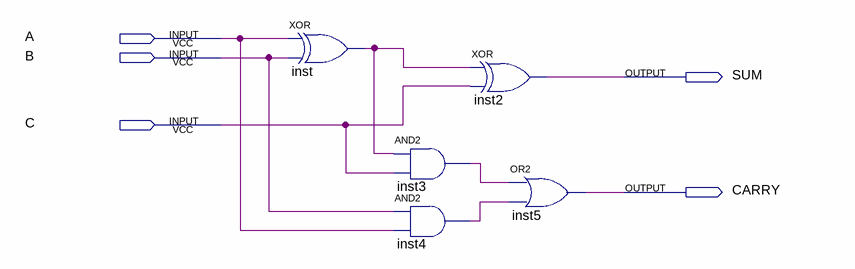
[diagram p0: schematic sheet]
// Quartus schematic 2BitAdder.bdf as structural Verilog: 5 symbols, 5 pins
module \2BitAdder  (
  input  A,
  input  B,
  input  C,
  output SUM,
  output CARRY
);

  wire inst3_out, inst4_out, inst_out;

  xor inst (inst_out, A, B);
  and inst3 (inst3_out, inst_out, C);
  and inst4 (inst4_out, B, A);
  xor inst2 (SUM, inst_out, C);
  or inst5 (CARRY, inst3_out, inst4_out);
endmodule
